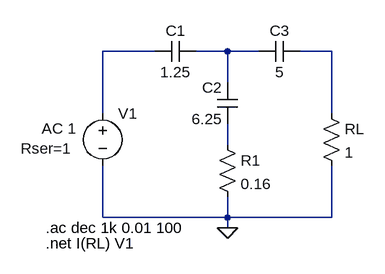
[diagram p0: schematic ej1_a.asc]
ej1_a.asc, the LTspice schematic file:
Version 4
SHEET 1 880 680
WIRE 96 112 16 112
WIRE 208 112 160 112
WIRE 256 112 208 112
WIRE 368 112 320 112
WIRE 208 160 208 112
WIRE 16 208 16 112
WIRE 368 208 368 112
WIRE 208 256 208 224
WIRE 16 368 16 288
WIRE 208 368 208 336
WIRE 208 368 16 368
WIRE 368 368 368 288
WIRE 368 368 208 368
WIRE 208 384 208 368
FLAG 208 384 0
SYMBOL voltage 16 192 R0
WINDOW 123 -94 39 Left 2
WINDOW 39 -126 70 Left 2
SYMATTR InstName V1
SYMATTR Value ""
SYMATTR Value2 AC 1
SYMATTR SpiceLine Rser=1
SYMBOL cap 160 96 R90
WINDOW 0 0 32 VBottom 2
WINDOW 3 32 32 VTop 2
SYMATTR InstName C1
SYMATTR Value 1.25
SYMBOL cap 224 224 R180
WINDOW 0 24 56 Left 2
WINDOW 3 24 8 Left 2
SYMATTR InstName C2
SYMATTR Value 6.25
SYMBOL cap 256 128 R270
WINDOW 0 32 32 VTop 2
WINDOW 3 0 32 VBottom 2
SYMATTR InstName C3
SYMATTR Value 5
SYMBOL res 192 240 R0
SYMATTR InstName R1
SYMATTR Value 0.16
SYMBOL res 352 192 R0
SYMATTR InstName RL
SYMATTR Value 1
TEXT -72 384 Left 2 !.ac dec 1k 0.01 100
TEXT -72 408 Left 2 !.net I(RL) V1

The netlist it stands for:
* ej1_a.asc
V1 N001 0 AC 1 Rser=1
C1 N002 N001 1.25
C2 N004 N002 6.25
C3 N002 N003 5
R1 N004 0 0.16
RL N003 0 1
.ac dec 1k 0.01 100
.net I(RL) V1
.backanno
.end